# EAGLE design InstrDigitizer3 (EAGLE 8.5.2)

## Sheet 1 of 2
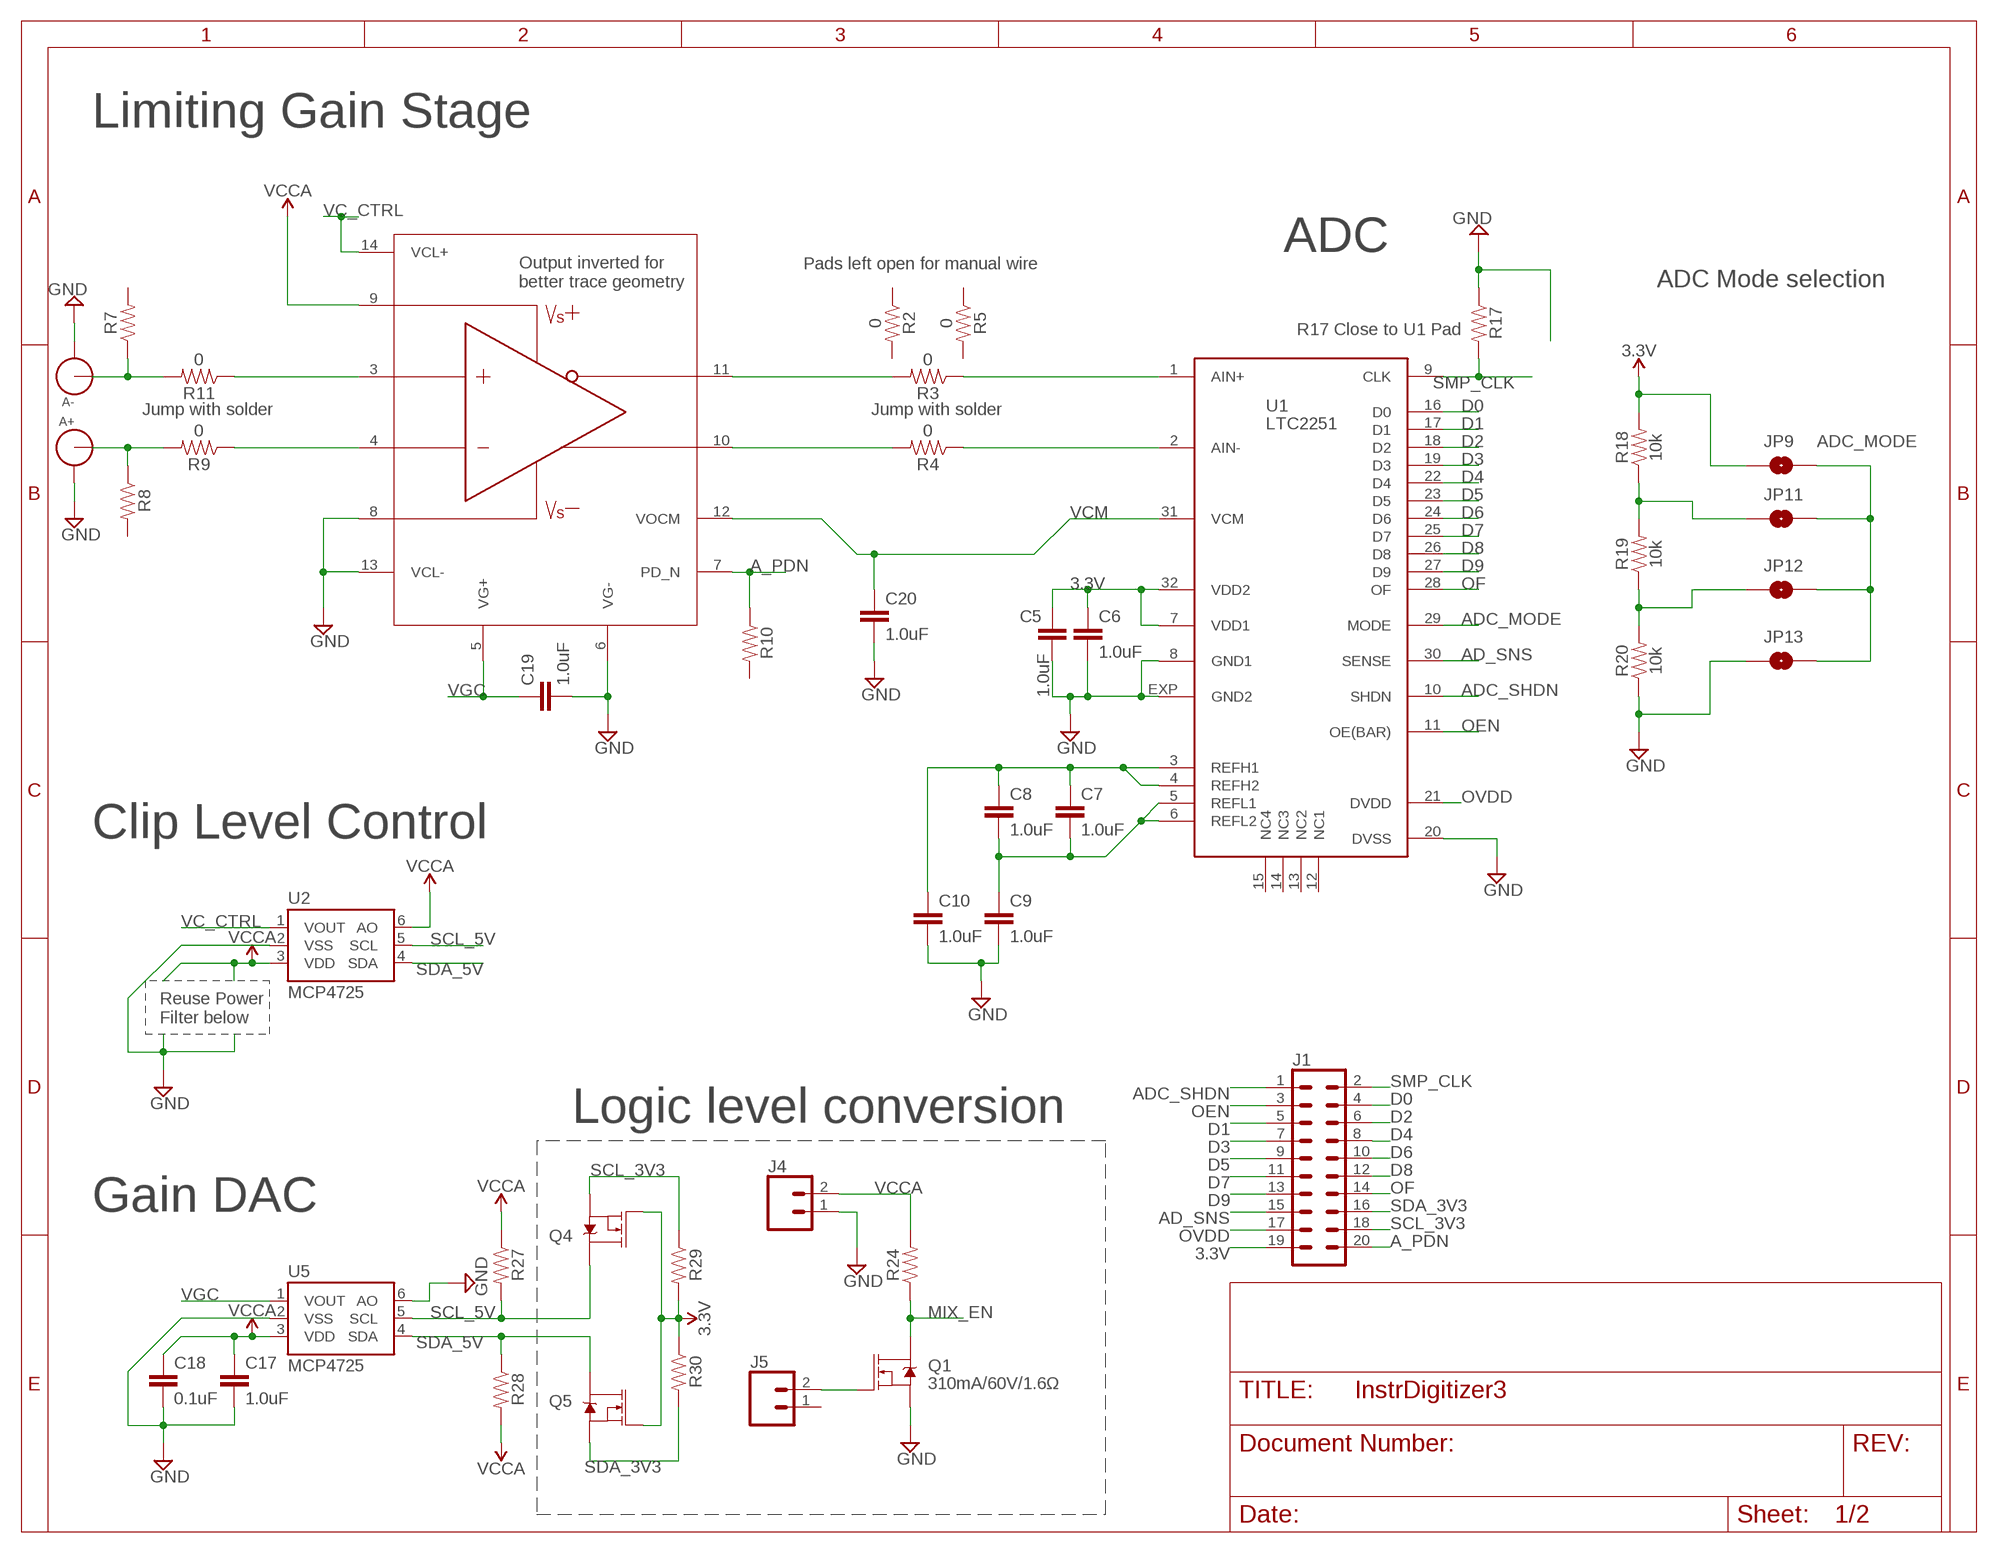
[diagram p0: schematic, sheet 1]

### Parts
A+  LINX-SMA-EDGE-0.062  [CONSMA003.062]
A-  LINX-SMA-EDGE-0.062  [CONSMA003.062]
C5  1.0uF  1.0UF-0402-16V-10%  [0402]
C6  1.0uF  1.0UF-0402-16V-10%  [0402]
C7  1.0uF  1.0UF-0402-16V-10%  [0402]
C8  1.0uF  1.0UF-0402-16V-10%  [0402]
C9  1.0uF  1.0UF-0402-16V-10%  [0402]
C10  1.0uF  1.0UF-0402-16V-10%  [0402]
C17  1.0uF  1.0UF-0402-16V-10%  [0402]
C18  0.1uF  0.1UF-0402-16V-10%  [0402]
C19  1.0uF  1.0UF-0402-16V-10%  [0402]
C20  1.0uF  1.0UF-0402-16V-10%  [0402]
J1  CONN_10X2  [2X10]
J4  CONN_02  [1X02]
J5  CONN_02  [1X02]
JP9  JUMPER-SMT_2_NO_NO-SILK  [SMT-JUMPER_2_NO_NO-SILK]
JP11  JUMPER-SMT_2_NO_NO-SILK  [SMT-JUMPER_2_NO_NO-SILK]
JP12  JUMPER-SMT_2_NO_NO-SILK  [SMT-JUMPER_2_NO_NO-SILK]
JP13  JUMPER-SMT_2_NO_NO-SILK  [SMT-JUMPER_2_NO_NO-SILK]
Q1  310mA/60V/1.6Ω  MOSFET-NCH-2N7002PW  [SOT323]
Q4  MOSFET-NCH-AO3404A  [SOT23-3]
Q5  MOSFET-NCH-AO3404A  [SOT23-3]
R2  0  RESISTOR0402  [0402]
R3  0  RESISTOR0402  [0402]
R4  0  RESISTOR0402  [0402]
R5  0  RESISTOR0402  [0402]
R7  RESISTOR0402  [0402]
R8  RESISTOR0402  [0402]
R9  0  RESISTOR0402  [0402]
R10  RESISTOR0402  [0402]
R11  0  RESISTOR0402  [0402]
R17  RESISTOR0402  [0402]
R18  10k  RESISTOR0402  [0402]
R19  10k  RESISTOR0402  [0402]
R20  10k  RESISTOR0402  [0402]
R24  RESISTOR0402  [0402]
R27  RESISTOR0402  [0402]
R28  RESISTOR0402  [0402]
R29  RESISTOR0402  [0402]
R30  RESISTOR0402  [0402]
U1  LTC2251  [HVQFN32]
U2  MCP4725  MCP4725SOT-23  [SOT23-6]
U5  MCP4725  MCP4725SOT-23  [SOT23-6]
U$1  THS7530  [TSSOP14]

### Nets
3.3V: C5.1 C6.1 J1.19 JP9.1 Q4.1(G) Q5.1(G) R18.2 R29.2 R30.1 U1.7(VDD1) U1.32(VDD2) ; also sheet 2
A_PDN: J1.20 R10.1 U$1.7(PD_N)
AD_SNS: J1.15 U1.30(SENSE)
ADC_MODE: JP9.2 JP11.2 JP12.2 JP13.2 U1.29(MODE)
ADC_SHDN: J1.1 U1.10(SHDN)
D0: J1.4 U1.16(D0)
D1: J1.5 U1.17(D1)
D2: J1.6 U1.18(D2)
D3: J1.7 U1.19(D3)
D4: J1.8 U1.22(D4)
D5: J1.9 U1.23(D5)
D6: J1.10 U1.24(D6)
D7: J1.11 U1.25(D7)
D8: J1.12 U1.26(D8)
D9: J1.13 U1.27(D9)
GND: A+.GND1 A+.GND2 A+.GND3 A+.GND4 A-.GND1 A-.GND2 A-.GND3 A-.GND4 C5.2 C6.2 C9.2 C10.2 C17.2 C18.2 C19.2 C20.2 J4.1 JP13.1 Q1.2(S) R17.1 R20.1 U1.8(GND1) U1.20(DVSS) U1.EXP(GND2) U2.2(VSS) U5.2(VSS) U5.6(AO) U$1.6(VG-) U$1.8 U$1.13(VCL-) ; also sheet 2
MIX_EN: Q1.3(D) R24.1 ; also sheet 2
N$1: R11.1 U$1.3
N$2: A+.ANT R8.1 R9.2
N$3: J5.2 Q1.1(G)
N$4: R3.1 U1.1(AIN+)
N$5: R3.2 U$1.11(VO-)
N$6: R4.1 U1.2(AIN-)
N$7: R4.2 U$1.10(VO+)
N$10: A-.ANT R7.1 R11.2
N$11: R9.1 U$1.4
N$21: C7.1 C8.1 C10.1 U1.3(REFH1) U1.4(REFH2)
N$22: JP12.1 R19.1 R20.2
N$23: C7.2 C8.2 C9.1 U1.5(REFL1) U1.6(REFL2)
N$30: JP11.1 R18.1 R19.2
OEN: J1.3 U1.11(OE(BAR))
OF: J1.14 U1.28(OF)
OVDD: J1.17 U1.21(DVDD)
SCL_3V3: J1.18 Q4.2(S) R29.1
SCL_5V: Q4.3(D) R27.2 U2.5(SCL) U5.5(SCL)
SDA_3V3: J1.16 Q5.2(S) R30.2
SDA_5V: Q5.3(D) R28.1 U2.4(SDA) U5.4(SDA)
SMP_CLK: J1.2 R17.2 U1.9(CLK)
VC_CTRL: U2.1(VOUT) U$1.14(VCL+)
VCCA: C17.1 C18.1 J4.2 R24.2 R27.1 R28.2 U2.3(VDD) U2.6(AO) U5.3(VDD) U$1.9 ; also sheet 2
VCM: C20.1 U1.31(VCM) U$1.12(VOCM)
VGC: C19.1 U5.1(VOUT) U$1.5(VG+)
Unconnected: J5.1 R2.1 R2.2 R5.1 R5.2 R7.2 R8.2 R10.2 U1.12(NC1) U1.13(NC2) U1.14(NC3) U1.15(NC4)

### Notes on the sheet
- Limiting Gain Stage
- ADC
- Pads left open for manual wire
- Output inverted for 
  better trace geometry
- ADC Mode selection
- R17 Close to U1 Pad
- Jump with solder | Jump with solder
- Clip Level Control
- Reuse Power
  Filter below
- Logic level conversion
- Gain DAC

## Sheet 2 of 2
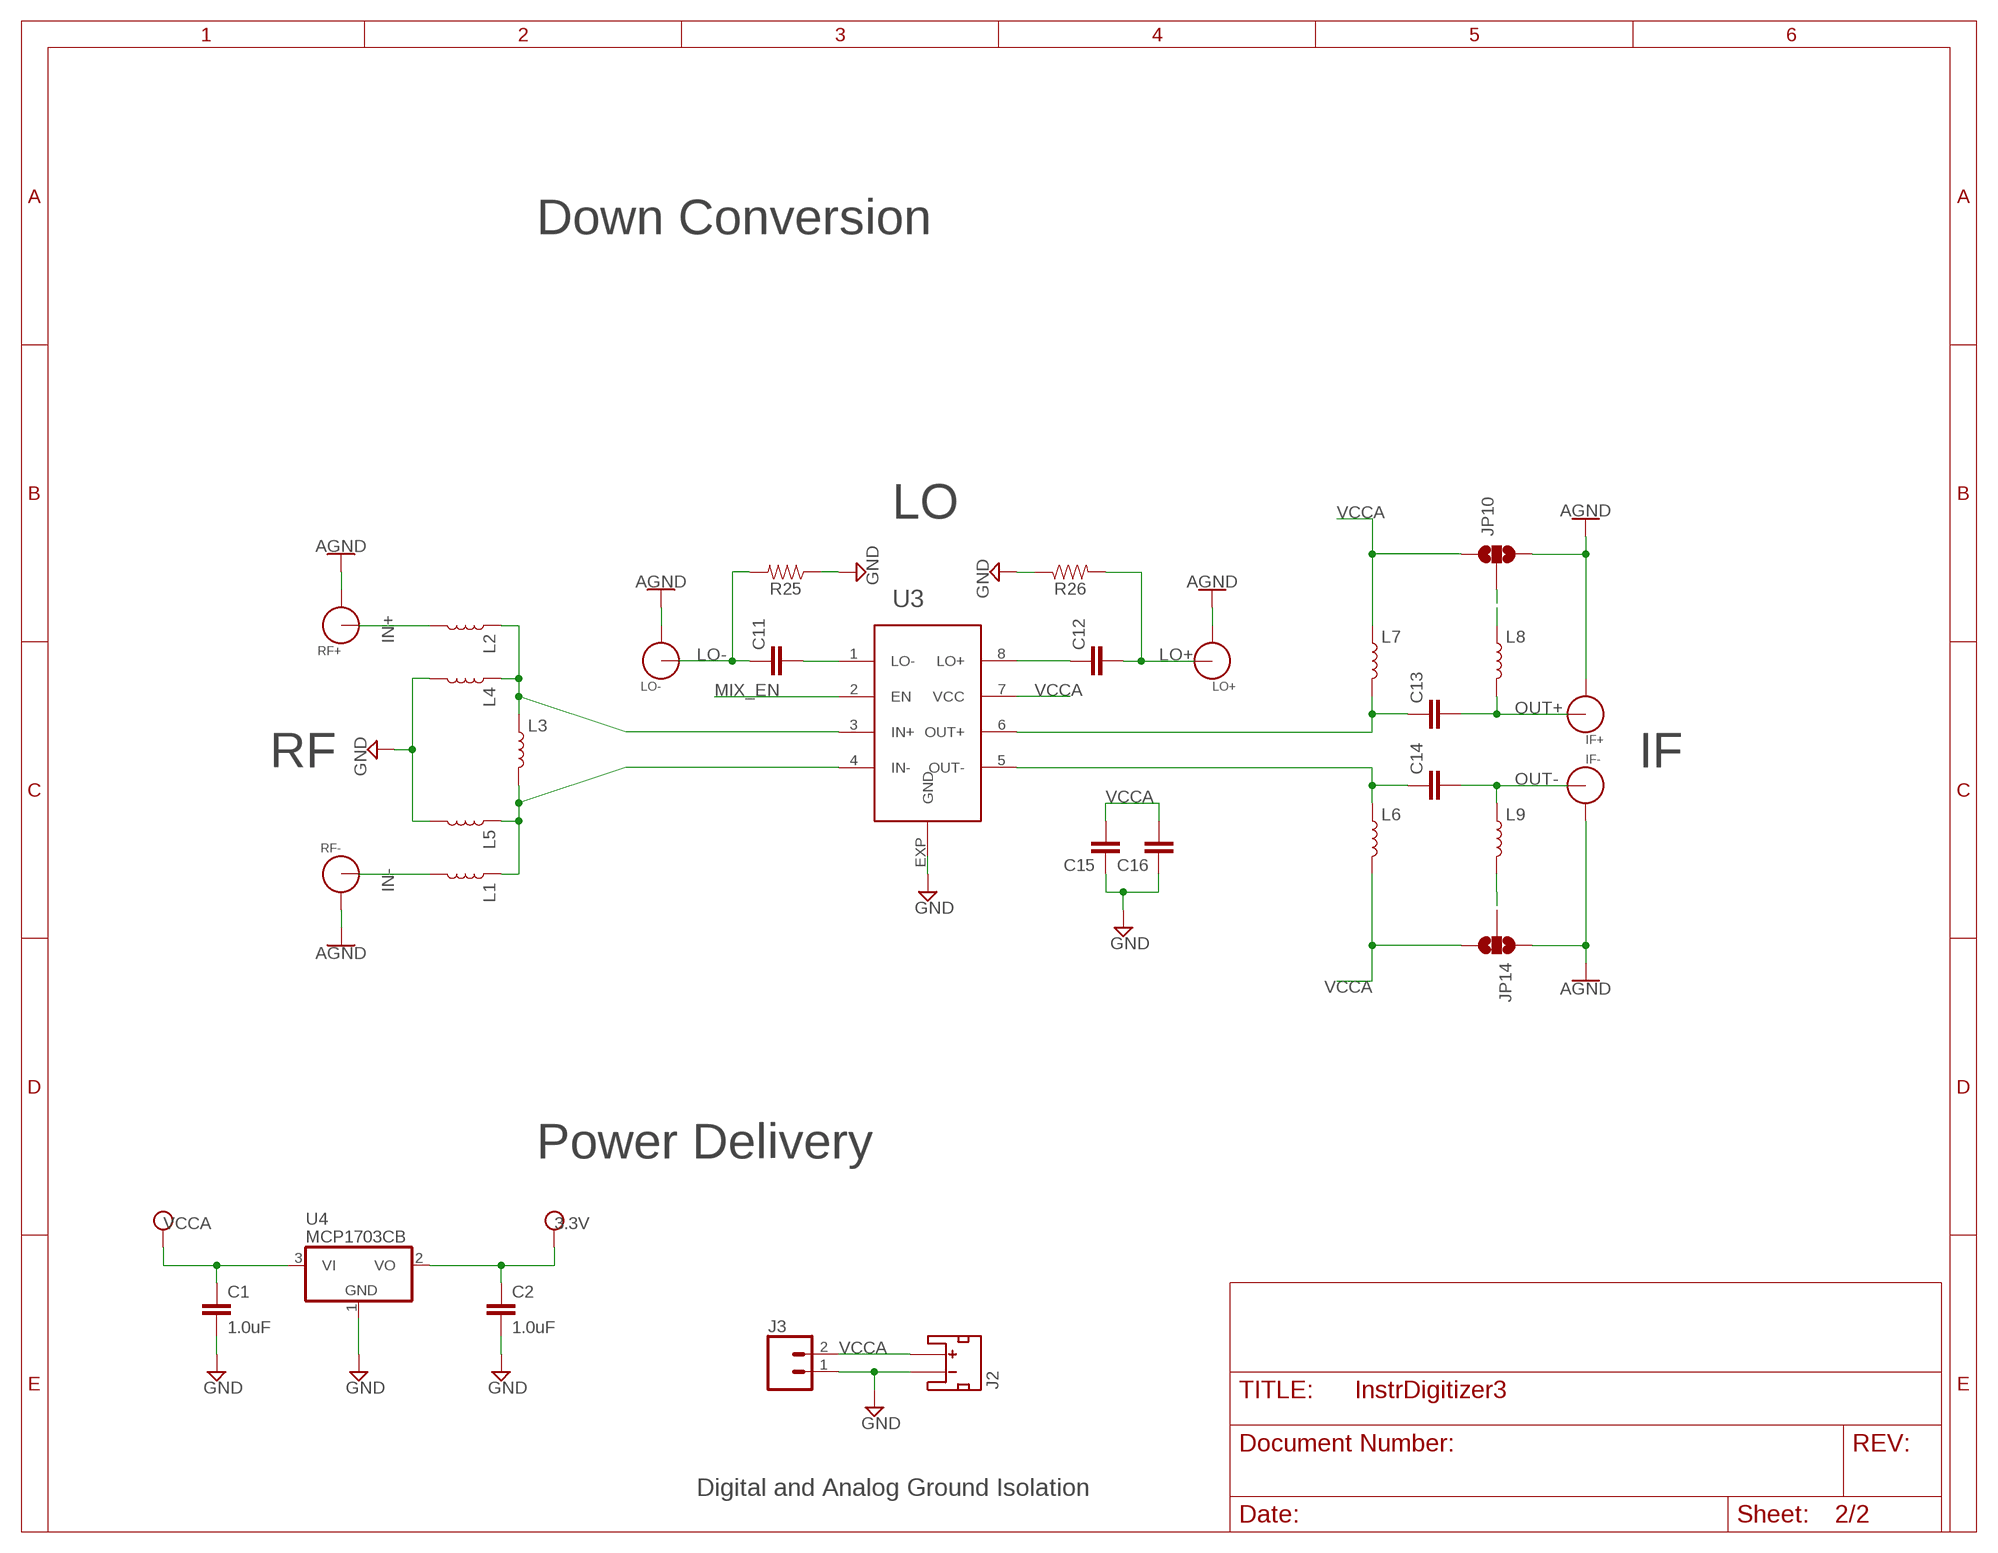
[diagram p1: schematic, sheet 2]

### Parts
C1  1.0uF  1.0UF-0402-16V-10%  [0402]
C2  1.0uF  1.0UF-0402-16V-10%  [0402]
C11  1.0UF-0402-16V-10%  [0402]
C12  1.0UF-0402-16V-10%  [0402]
C13  1.0UF-0402-16V-10%  [0402]
C14  1.0UF-0402-16V-10%  [0402]
C15  1.0UF-0402-16V-10%  [0402]
C16  1.0UF-0402-16V-10%  [0402]
IF+  LINX-SMA-EDGE-0.062  [CONSMA003.062]
IF-  LINX-SMA-EDGE-0.062  [CONSMA003.062]
J2  JST_2MM_MALE  [JST-2-SMD]
J3  CONN_02  [1X02]
JP10  JUMPER-SMT_3_NO_NO-SILK  [SMT-JUMPER_3_NO_NO-SILK]
JP14  JUMPER-SMT_3_NO_NO-SILK  [SMT-JUMPER_3_NO_NO-SILK]
L1  INDUCTOR-0603-33NH  [0603]
L2  INDUCTOR-0603-33NH  [0603]
L3  INDUCTOR-0603-33NH  [0603]
L4  INDUCTOR-0603-33NH  [0603]
L5  INDUCTOR-0603-33NH  [0603]
L6  INDUCTOR-0603-33NH  [0603]
L7  INDUCTOR-0603-33NH  [0603]
L8  INDUCTOR-0603-33NH  [0603]
L9  INDUCTOR-0603-33NH  [0603]
LO+  LINX-SMA-EDGE-0.062  [CONSMA003.062]
LO-  LINX-SMA-EDGE-0.062  [CONSMA003.062]
R25  RESISTOR0402  [0402]
R26  RESISTOR0402  [0402]
RF+  LINX-SMA-EDGE-0.062  [CONSMA003.062]
RF-  LINX-SMA-EDGE-0.062  [CONSMA003.062]
U3  LT5560  [DFN8-3X3]
U4  MCP1703CB  [SOT23]

### Nets
3.3V: C2.1 U4.2(VO) ; supply symbol labelled VDD ; also sheet 1
GND: C1.2 C2.2 C15.1 C16.1 IF+.GND1 IF+.GND2 IF+.GND3 IF+.GND4 IF-.GND1 IF-.GND2 IF-.GND3 IF-.GND4 J2.1(-) J3.1 JP10.3 JP14.1 L4.2 L5.2 LO+.GND1 LO+.GND2 LO+.GND3 LO+.GND4 LO-.GND1 LO-.GND2 LO-.GND3 LO-.GND4 R25.1 R26.1 RF+.GND1 RF+.GND2 RF+.GND3 RF+.GND4 RF-.GND1 RF-.GND2 RF-.GND3 RF-.GND4 U3.EXP(GND) U4.1(GND) ; supply symbol labelled AGND ; also sheet 1
IN+: L2.2 RF+.ANT
IN-: L1.2 RF-.ANT
LO+: C12.2 LO+.ANT R26.2
LO-: C11.1 LO-.ANT R25.2
MIX_EN: U3.2(EN) ; also sheet 1
N98: L1.1 L3.2 L5.1 U3.4(IN-)
N$20: C11.2 U3.1(LO-)
N$24: C12.1 U3.8(LO+)
N$25: L2.1 L3.1 L4.1 U3.3(IN+)
N$26: C14.1 L6.1 U3.5(OUT-)
N$27: C13.1 L7.2 U3.6(OUT+)
N$37: JP10.2 L8.1
N$38: JP14.2 L9.2
OUT+: C13.2 IF+.ANT L8.2
OUT-: C14.2 IF-.ANT L9.1
VCCA: C1.1 C15.2 C16.2 J2.2(+) J3.2 JP10.1 JP14.3 L6.2 L7.1 U3.7(VCC) U4.3(VI) ; supply symbol labelled VCC ; also sheet 1
Unconnected: J2.NC1(PAD1) J2.NC2(PAD2)

### Notes on the sheet
- Down Conversion
- LO
- U3
- RF | IF
- Power Delivery
- Digital and Analog Ground Isolation

## Library data of the parts
A+ A- IF+ IF- LO+ LO- RF+ RF- = connector:LINX-SMA-EDGE-0.062: CONN SMA JACK 50 OHM EDGE MNT; DIGIKEY: CONSMA003.062-ND
C1 C2 C5-C10 C17 C19 C20 = SparkFun-Capacitors:1.0UF: 1µF ceramic capacitors A capacitor is a passive two-terminal electrical component used to store electrical energy temporarily in an electric field.; PROD_ID: CAP-12417
C11-C16 = SparkFun-Capacitors:1.0UF: 1µF ceramic capacitors A capacitor is a passive two-terminal electrical component used to store electrical energy temporarily in an electric field.; PROD_ID: CAP-12417; VALUE: 1.0uF
C18 = SparkFun-Capacitors:0.1UF: 0.1µF ceramic capacitors A capacitor is a passive two-terminal electrical component used to store electrical energy temporarily in an electric field.; PROD_ID: CAP-12416
J1 = SparkFun-Connectors:CONN_10X2: Multi connection point. Often used as Generic Header-pin footprint for 0.1 inch spaced/style header connections On any of the 0.1 inch spaced packages, you can populate with these: Break Away Headers - Straight <https://www.sparkfun.com/products/116> (PRT-00116) Break Away Male Headers - Right Angle <https://www.sparkfun.com/products/553> (PRT-00553) Female Headers <https://www.sparkfun.com/products/115> (PRT-00115) Break Away Headers - Machine Pin <https://www.sparkfun.com/products/117> (PRT-00117) Break Away Female Headers - Swiss Machine Pin <https://www.sparkfun.com/products/743> (PRT-00743) Special note about the "SPECIAL" package: This was SPECIALLY designed to be used with our Graphic LCD Backpack. Be sure you want to use this! It is not only staggered on each line of header holes, but IT IS ALSO offset of the center point of the top and bottom lines by 5 mil. This causes the headers to lock into place on the "standard" footprint on the LCD screen. The extra squares on the tdocu layer are there simply to reference other pins (if you were to actually populate a longer header than ten long - this is what we do with the backpacks).
J2 = SparkFun-Connectors:JST_2MM_MALE: JST 2MM MALE RA CONNECTOR Two pin, compact surface mount connector. Commonly used as a battery input connection point. We really like the solid locking feeling and high current rating on these small connectors. We use these all the time as battery connectors. Mates to single-cell LiPo batteries. Here is the connector we sell at SparkFun: JST Right Angle Connector - White <https://www.sparkfun.com/products/8612> (PRT-08612) Datasheet <http://www.sparkfun.com/datasheets/Prototyping/Connectors/JST-Horizontal.pdf> It was used on these SparkFun products: SparkFun MOSFET Power Controller <https://www.sparkfun.com/products/11214> (PRT-11214) SparkFun Battery Babysitter - LiPo Battery Manager <https://www.sparkfun.com/products/13777> (PRT-13777) And many, many others that required a lipo battery connection.; PROD_ID: CONN-11443; SF_ID: PRT-08612
J3-J5 = SparkFun-Connectors:CONN_02: Multi connection point. Often used as Generic Header-pin footprint for 0.1 inch spaced/style header connections On any of the 0.1 inch spaced packages, you can populate with these: Break Away Headers - Straight <https://www.sparkfun.com/products/116> (PRT-00116) Break Away Male Headers - Right Angle <https://www.sparkfun.com/products/553> (PRT-00553) Female Headers <https://www.sparkfun.com/products/115> (PRT-00115) Break Away Headers - Machine Pin <https://www.sparkfun.com/products/117> (PRT-00117) Break Away Female Headers - Swiss Machine Pin <https://www.sparkfun.com/products/743> (PRT-00743) For SCREWTERMINALS and SPRING TERMINALS visit here: Screw Terimnals on SparkFun.com <https://www.sparkfun.com/search/results?term=Screw+Terminals> (5mm/3.5mm/2.54mm spacing) This device is also useful as a general connection point to wire up your design to another part of your project. Our various solder wires solder well into these plated through hole pads. Hook-Up Wire - Assortment (Stranded, 22 AWG) <https://www.sparkfun.com/products/11375> (PRT-11375) Hook-Up Wire - Assortment (Solid Core, 22 AWG) <https://www.sparkfun.com/products/11367> (PRT-11367) View the entire wire category on our website here <https://www.sparkfun.com/categories/141> Special notes: Molex polarized connector foot print use with: PRT-08233 with associated crimp pins and housings. 2.54_SCREWTERM for use with PRT-10571. 3.5mm Screw Terminal footprints for PRT-08084 5mm Screw Terminal footprints for use with PRT-08432
JP9 JP11-JP13 = SparkFun-Jumpers:JUMPER-SMT_2_NO: Normally open jumper This jumper has two pads in close proximity to each other. Apply solder to close the connection. Round pads are easier to solder for beginners, but are a lot larger. SparkFun Product that uses the round pads: SparkFun EL Sequencer <https://www.sparkfun.com/products/12781>
JP10 JP14 = SparkFun-Jumpers:JUMPER-SMT_3_NO: Normally open jumper This jumper has three pads in close proximity to each other. Apply solder to close the connection(s).
L1-L9 = SparkFun-Coils:INDUCTOR: Inductors Resist changes in electrical current. Basically a coil of wire. SparkFun Products: SparkFun Load Cell Amplifier - HX711 <https://www.sparkfun.com/products/13879> IOIO-OTG - V2.2 <https://www.sparkfun.com/products/13613>; PROD_ID: NDUC-07874; VALUE: 33nH/±5%/500mA
Q1 = SparkFun-DiscreteSemi:MOSFET-NCH: N-channel MOSFETs Voltage controlled devices that allow control of high current outputs. SparkFun Products: SparkFun OpenScale <https://www.sparkfun.com/products/13261> SparkFun Digital Sandbox <https://www.sparkfun.com/products/12651> SparkFun Monster Moto Shield <https://www.sparkfun.com/products/10182> SparkFun MOSFET Power Controller <https://www.sparkfun.com/products/11214>; PROD_ID: TRANS-11151
Q4 Q5 = SparkFun-DiscreteSemi:MOSFET-NCH: N-channel MOSFETs Voltage controlled devices that allow control of high current outputs. SparkFun Products: SparkFun OpenScale <https://www.sparkfun.com/products/13261> SparkFun Digital Sandbox <https://www.sparkfun.com/products/12651> SparkFun Monster Moto Shield <https://www.sparkfun.com/products/10182> SparkFun MOSFET Power Controller <https://www.sparkfun.com/products/11214>; PROD_ID: TRANS-12988; VALUE: 5.8A/30V/35mΩ
R2-R5 R7-R11 R17-R20 R24-R30 = SparkFun-Resistors:RESISTOR: Generic Resistor Package
U1 = components:LTC2251: LTC2251 125MSPS Pipelined ADC
U2 U5 = SparkFun-IC-Conversion:MCP4725: MCP4725 DAC Microchip 12-bit I2C DAC, SOT23-6 Datasheet <https://cdn.sparkfun.com/datasheets/BreakoutBoards/MCP4725_2009.pdf> SparkFun Products SparkFun I2C DAC Breakout - MCP4725 <https://www.sparkfun.com/products/12918> (BOB-12918); PROD_ID: IC-08886
U3 = components:LT5560
U4 = linear:MCP1703: 250 mA, 16V, Low Quiescent Current LDO Regulator Source: http://ww1.microchip.com/downloads/en/DeviceDoc/22049b.pdf
U$1 = components:THS7530

## Board
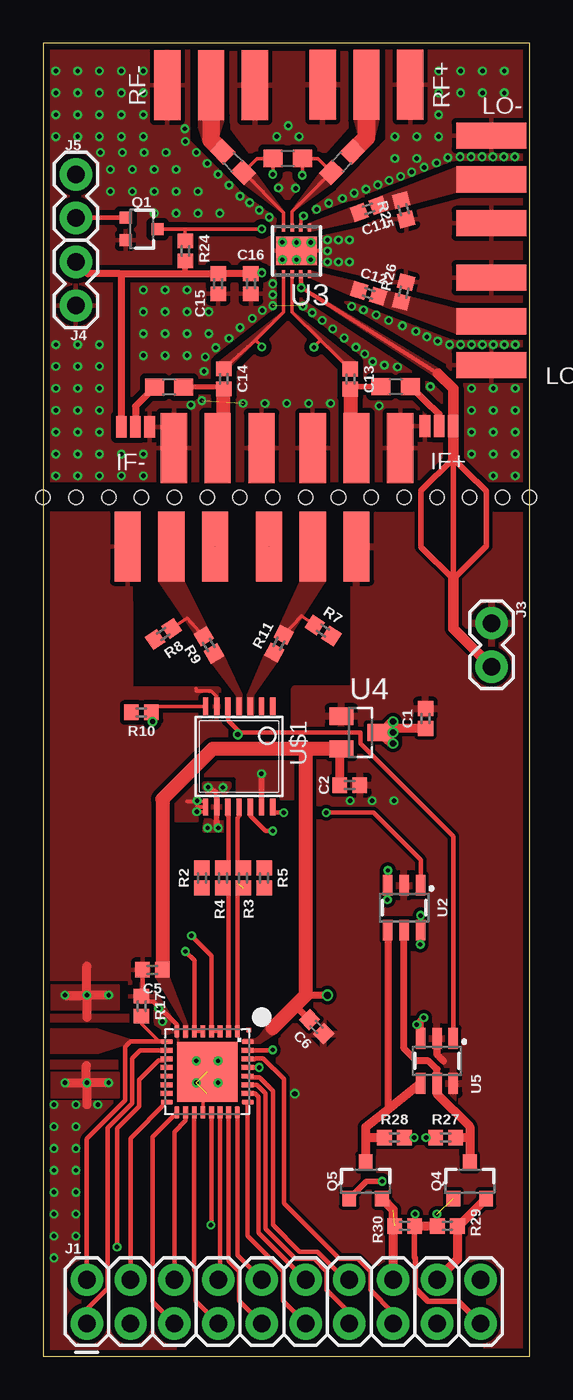
[diagram p2: board, top side]
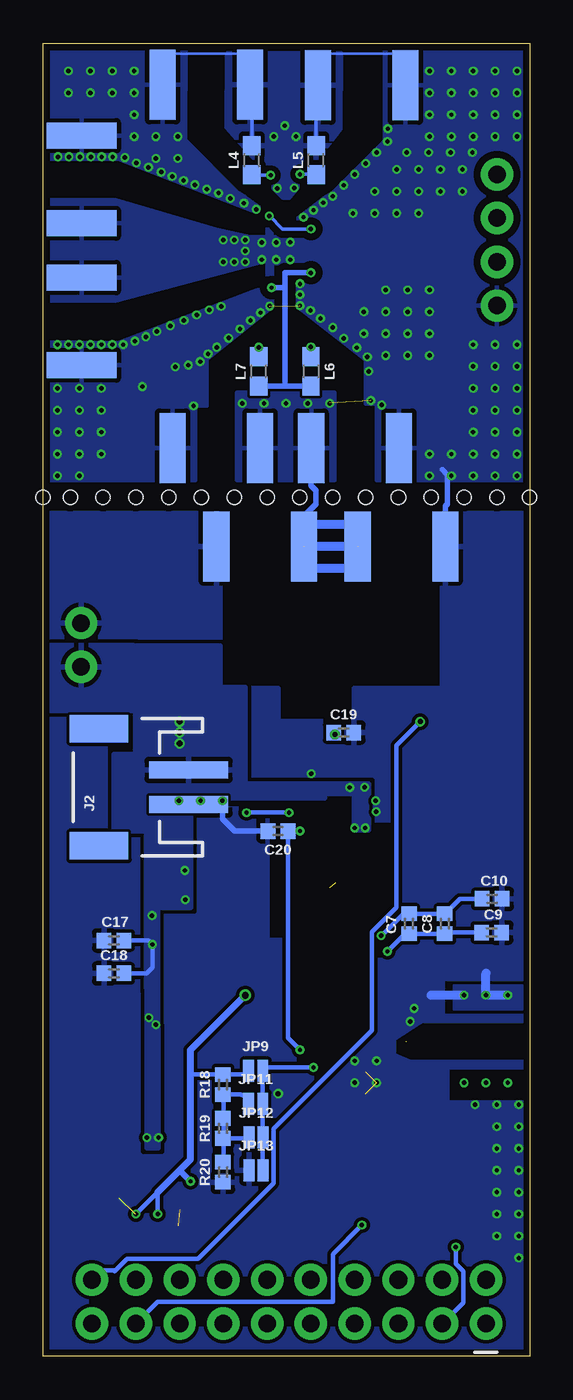
[diagram p3: board, bottom side, seen from below]

Size 28.25 x 76.19 mm. Coordinates in mm from the lower left corner, seen from the top.
Outline: 0,0 28.25,0 28.25,76.19 0,76.19 0,0
Copper layers (1*16): Top 0.0356mm / dielectric 60mil / Bottom 0.0356mm
Design rules "default *": minimum track width 6mil, minimum drill 10mil, track to track 6mil, track to pad 6mil, pad to pad 6mil, via to via 6mil, smd to smd 0mil, copper to edge 15mil, drill to drill 10mil, minimum pad ring 5mil, minimum via ring 5mil, stop-mask expansion 4mil, vias tented up to drill 20mil, thermal gap 10mil
Holes 0.8 mm at 0,49.83 1.91,49.83 3.81,49.83 5.71,49.83 7.62,49.83 9.53,49.83 11.43,49.83 13.34,49.83 15.24,49.83 17.14,49.83 19.05,49.83 20.95,49.83 22.86,49.83 24.77,49.83 26.67,49.83 28.24,49.83

### Footprints (pad centres in the part's own frame; a part is rotated, then mirrored left to right if it is on the bottom)
CONSMA003.062 = smd 4.06 x 1.52: ANT 0,0; GND1 0,2.54; GND2 0,-2.54 | smd 4.06 x 1.52 bottom: GND3 0,2.54; GND4 0,-2.54
0402 = smd 0.85 x 0.9: 1 -0.58,0; 2 0.58,0
2X10 = drill 1.016 pad 1.88: 1 0,0; 2 0,2.54; 3 2.54,0; 4 2.54,2.54; 5 5.08,0; 6 5.08,2.54; 7 7.62,0; 8 7.62,2.54; 9 10.16,0; 10 10.16,2.54; 11 12.7,0; 12 12.7,2.54; 13 15.24,0; 14 15.24,2.54; 15 17.78,0; 16 17.78,2.54; 17 20.32,0; 18 20.32,2.54; 19 22.86,0; 20 22.86,2.54
JST-2-SMD = smd 1 x 4.6: 1 -1,-3.7; 2 1,-3.7 | smd 1.6 x 3.4: NC1 -3.4,1.5; NC2 3.4,1.5
1X02 = drill 1.016 pad 1.88: 1 0,0; 2 2.54,0
SMT-JUMPER_2_NO_NO-SILK = smd 0.635 x 1.27: 1 -0.406,0; 2 0.406,0
SMT-JUMPER_3_NO_NO-SILK = smd 0.635 x 1.27: 1 -0.813,0; 2 0,0; 3 0.813,0
0603 = smd 1.1 x 1: 1 -0.85,0; 2 0.85,0
SOT323 = smd 0.7 x 0.7: 1 -0.65,-0.925; 2 0.65,-0.925; 3 0,0.925
SOT23-3 = smd 0.8 x 0.9: 1 -0.95,-1; 2 0.95,-1; 3 0,1.1
HVQFN32 = smd 0.7 x 0.28: 1 -2.35,1.75; 2 -2.35,1.25; 3 -2.35,0.75; 4 -2.35,0.25; 5 -2.35,-0.25; 6 -2.35,-0.75; 7 -2.35,-1.25; 8 -2.35,-1.75; 17 2.35,-1.75; 18 2.35,-1.25; 19 2.35,-0.75; 20 2.35,-0.25; 21 2.35,0.25; 22 2.35,0.75; 23 2.35,1.25; 24 2.35,1.75 | smd 0.28 x 0.7: 9 -1.75,-2.35; 10 -1.25,-2.35; 11 -0.75,-2.35; 12 -0.25,-2.35; 13 0.25,-2.35; 14 0.75,-2.35; 15 1.25,-2.35; 16 1.75,-2.35; 25 1.75,2.35; 26 1.25,2.35; 27 0.75,2.35; 28 0.25,2.35; 29 -0.25,2.35; 30 -0.75,2.35; 31 -1.25,2.35; 32 -1.75,2.35 | smd 3.5 x 3.5: EXP 0,0 | smd 0.25 x 0.25: M1 -2.415,2.415
SOT23-6 = smd 0.55 x 1.2: 1 0.95,1.3; 2 0,1.3; 3 -0.95,1.3; 4 -0.95,-1.3; 5 0,-1.3; 6 0.95,-1.3
DFN8-3X3 = smd 0.25 x 0.45: 1 -0.75,-1.35; 2 -0.25,-1.35; 3 0.25,-1.35; 4 0.75,-1.35; 5 0.75,1.35; 6 0.25,1.35; 7 -0.25,1.35; 8 -0.75,1.35 | smd 2.38 x 1.65: EXP 0,0
SOT23 = smd 1 x 1.4: 1 -0.95,-1.1; 2 0.95,-1.1; 3 0,1.1
TSSOP14 = smd 0.305 x 0.991: 1 -1.95,-2.918; 2 -1.3,-2.918; 3 -0.65,-2.918; 4 0,-2.918; 5 0.65,-2.918; 6 1.3,-2.918; 7 1.95,-2.918; 8 1.95,2.918; 9 1.3,2.918; 10 0.65,2.918; 11 0,2.918; 12 -0.65,2.918; 13 -1.3,2.918; 14 -1.95,2.918

### Placement (x,y rotation side)
A+  7.44,46.99 90 top
A-  15.65,46.99 270 top
C1  22.2,37.01 90 top
C2  17.81,33.15 0 top
C5  6.35,22.43 180 top
C6  15.88,19.13 315 top
C7  7.01,25.1 270 bottom
C8  4.93,25.1 270 bottom
C9  2.21,24.59 0 bottom
C10  2.18,26.54 0 bottom
C11  18.9,66.57 200 top
C12  18.9,61.67 343 top
C13  17.83,56.69 270 top
C14  10.49,56.72 270 top
C15  10.16,62.23 90 top
C16  12.06,62.23 90 top
C17  24.13,24.13 180 bottom
C18  24.13,22.22 180 bottom
C19  10.79,36.2 0 bottom
C20  14.61,30.48 180 bottom
IF+  18.19,52.71 90 top
IF-  10.13,52.71 270 top
J1  2.54,1.91 0 top
J2  23.5,33.02 90 bottom
J3  26.04,42.55 270 top
J4  1.91,60.96 90 top
J5  1.91,68.58 270 top
JP9  15.9,16.56 0 bottom
JP10  22.99,53.98 180 top
JP11  15.9,14.66 0 bottom
JP12  15.88,12.7 0 bottom
JP13  15.88,10.79 0 bottom
JP14  5.36,53.92 180 top
L1  11.02,69.29 135 top
L2  17.35,69.29 45 top
L3  14.2,69.49 180 top
L4  16.13,69.39 90 bottom
L5  12.4,69.39 90 bottom
L6  12.7,57.15 270 bottom
L7  15.72,57.15 90 bottom
L8  20.47,56.26 180 top
L9  7.32,56.24 180 top
LO+  26.01,60.05 0 top
LO-  26.01,68.28 0 top
Q1  5.71,65.41 270 top
Q4  24.77,10.16 0 top
Q5  18.72,10.16 0 top
R2  9.22,27.76 90 top
R3  11.61,27.76 90 top
R4  10.44,27.76 90 top
R5  12.83,27.76 270 top
R7  16.26,42.11 327 top
R8  6.99,41.91 214 top
R9  9.63,41.28 121 top
R10  5.71,37.36 180 top
R11  13.69,41.35 62 top
R17  5.71,20.32 270 top
R18  17.81,15.77 90 bottom
R19  17.81,13.23 90 bottom
R20  17.81,10.69 90 bottom
R24  8.26,64.13 270 top
R25  20.93,66.52 105 top
R26  20.93,61.75 256 top
R27  23.37,12.7 0 top
R28  20.4,12.7 0 top
R29  23.47,7.57 180 top
R30  20.98,7.57 180 top
RF+  18.77,73.76 270 top
RF-  9.75,73.74 90 top
U1  9.53,16.51 270 top
U2  20.95,26.04 0 top
U3  14.71,64.13 180 top
U4  18.41,36.2 270 top
U5  22.86,17.14 0 top
U$1  11.38,34.8 180 top

### Tracks (layer width: path | path; a pad name or v marks a point on that pad's centre or on a via)
3.3V  (via drill 0.25, 0.4)  (1 unrouted)
  Top 0.254: R30.1 21.56,8.23 v21.59,8.25 | R29.2 22.86,7.6 v22.86,8.25
  Top 0.305: Q5.1 18.77,10.16 v19.68,10.16 | R30.1 21.56,5.75 21.61,5.69 21.61,3.93 22.34,3.2 24.11,3.2 J1.19
  Top 0.406: C6.1 14.68,20.32 14.61,20.32 | v16.51,20.95 15.24,20.95
  Top 0.508: R30.1 R29.2 | C2.1 17.23,35.16 U4.2
  Top 0.61: U4.2 16.74,35.18
  Top 0.813: U4.2 15.24,35.25 | 15.24,35.25 9.85,35.25 6.93,32.33 C5.1 | 15.24,35.25 15.24,20.95 14.61,20.32 13.34,19.05
  Bottom 0.254: JP9.1 arc90 16.51,16.35 R18.2 19.68,16.35 19.68,16.51 | v22.86,8.25 21.59,9.52 v21.59,8.25
  Bottom 0.305: v19.68,10.16 20.32,10.79
  Bottom 0.406: 21.59,9.52 20.32,10.79 19.68,11.43 19.68,16.51 19.68,17.78 v16.51,20.95
  pour Top (isolate 0.203, no thermals): 13.34,19.05 13.08,19.28 12.52,18.54 12.37,18.39 11.63,18.39 11.58,18.34 11.58,18.19 12.6,18.19 13.56,18.8
  pour Top (no thermals): 7.32,22 6.55,22 8.18,19.25 8.18,18.52 8.38,18.52 8.38,19.2
A_PDN  (via drill 0.3)
  Top 0.203: R10.1 5.99,37.72 U$1.7
  Top 0.254: R10.1 6.29,36.89 v6.35,36.83
  Bottom 0.254: v6.35,36.83 7.74,35.44 7.74,26.04 9.15,24.63 9.15,18.91 14.87,13.19 14.87,10.04 19.25,5.66 23.36,5.66 24.04,4.99 | 24.04,4.99 24.08,4.95 | 24.04,4.99 24.86,4.99 J1.20
AD_SNS
  Top 0.254: U1.30 11.89,17.25 12.28,17.25 12.33,17.3 12.77,17.3 13.97,16.1 13.97,8.89 17.2,5.66 18.29,5.66 19,4.95 19,3.86 20.32,2.54 J1.15
ADC_MODE  (via drill 0.25 pad 0.25)
  Top 0.254: U1.29 v12.55,16.76
  Bottom 0.254: v12.55,16.76 15.29,16.76 arc-90 JP9.2 JP11.2 15.49,12.72 | JP12.2 arc90 15.49,12.72 | JP13.2 arc90 15.49,10.82 15.49,12.72
ADC_SHDN
  Top 0.254: J1.1 2.54,2.72 3.76,3.94 3.76,13.26 5.18,14.68 5.18,17.29 5.64,17.75 U1.10
D0
  Top 0.254: U1.16 5.08,12.66 J1.4
D1
  Top 0.254: U1.17 6.35,12.73 6.35,3.17 J1.5
D2
  Top 0.254: U1.18 8.28,13.68 7.62,13.03 J1.6
D3
  Top 0.254: U1.19 8.78,5.01 8.84,4.95 8.84,3.23 J1.7
D4
  Top 0.254: U1.22 10.28,4.56 J1.8
D5
  Top 0.254: U1.23 10.78,5.55 11.38,4.95 11.38,3.23 J1.9
D6
  Top 0.254: U1.24 11.28,5.87 J1.10
D7
  Top 0.254: J1.11 13.92,3.23 13.92,4.95 11.88,6.99 U1.25
D8
  Top 0.254: U1.26 12.3,15.26 12.5,15.05 12.5,7.18 J1.12
D9
  Top 0.254: U1.27 12.41,15.76 12.91,15.26 12.91,7.41 14.66,5.66 15.74,5.66 16.46,4.95 16.46,3.86 17.78,2.54 J1.13
GND  (via drill 0.25, 0.25 pad 0.25, 0.25 pad 0.3, 0.3)  (6 unrouted)
  Top 0.2: 9.75,38.61 8.89,38.61 8.89,38.73 | v8.91,31.6 9.43,31.6 U$1.8 | U$1.8 8.94,31.88 v8.94,32.23 | U$1.8 9.43,32.21 8.36,32.21 | R17.1 5.77,20.9 5.77,20.95
  Top 0.203: v16.51,64.13 U3.EXP | U1.20 9.28,14.99 9.53,15.24 | U$1.6 10.08,38.28 9.75,38.61
  Top 0.254: 7.78,19.07 U1.8 7.78,19.22 6.4,20.6 6.02,20.6 R17.1 5.95,20.9 | 5.77,20.95 C5.2
  Top 0.305: U$1.13 v12.68,33.8 v12.68,33.81
  Top 0.406: U5.2 22.86,17.53 23.24,17.14
  Top 0.508: v3.81,20.95 v2.54,20.95 | v2.54,20.95 2.54,19.68 | v1.27,20.95 v2.54,20.95 | v2.54,20.95 2.54,22.63 | v1.27,15.88 v2.54,15.88 2.54,14.61 | v3.81,15.88 2.52,15.88 2.52,16.87
  Bottom 0.152: RF-.GND1 7.62,74.14 7.62,75.56 12.06,75.56 12.29,75.34 RF-.GND4 | RF+.GND1 20.95,74.12 20.95,75.56 16.51,75.56 16.22,75.28 16.22,73.73
  Bottom 0.203: L5.2 12.39,73.33 RF-.GND4 | L4.2 16.13,73.33 16.22,73.73 RF+.GND4
  Bottom 0.305: C20.2 17.14,30.48 17.83,31.17 v17.83,32.23 | J2.1 20.01,32.23 v20.37,32.23 | A+.GND3 4.9,49.33 4.78,49.45 4.78,51.14 5.08,51.44 | A-.GND4 13.11,48.74 12.4,49.45 12.4,50.22 12.7,50.52 12.7,52.07 12.68,52.1 IF-.GND1
  Bottom 0.508: A+.GND4 A-.GND4 | A+.GND4 10.16,47.17 10.16,48.26 12.7,48.26 | A+.GND4 9.98,45.9 10.16,45.72 12.7,45.72 | v3.81,20.95 5.71,20.95 | v1.27,20.95 v2.54,20.95 2.54,22.22
  other vias: 8.89,17.14 10.16,17.14 10.16,15.88 21.39,68.71 20.75,68.45 20.09,68.22 19.43,67.97 18.75,67.72 18.06,67.49 17.37,67.18 16.59,66.9 15.88,66.55 16.51,64.77 16.51,63.5 17.14,63.5 17.78,63.5 17.14,64.77 17.78,64.77 22.91,58.9 23.6,58.7 18.67,58.17 18.16,58.55 17.48,59.08 16.81,59.61 16.21,60.1 15.62,60.55 15.09,60.93 13.34,62.23 13.34,61.6 13.34,60.96 12.73,60.68 12.14,60.22 11.43,59.69 10.79,59.05 13.13,66.09 12.55,66.5 11.99,66.93 11.43,67.31 10.79,67.94 10.16,68.58 9.53,69.21 8.89,69.85 8.26,70.48 10.03,58.52 9.42,57.99 9.35,57.15 22.28,59.16 22.12,68.99 8.23,71.22 9.22,55.45 8.59,55.19 19.13,57.71 19.81,57.51 22.48,56.26 19.51,55.14 13.67,67.79 14.66,67.77 13.56,70.76 14.86,70.76 17.91,60.91 18.59,60.71 19.33,60.43 20.07,60.1 20.85,59.79 21.64,59.46 8.89,15.88 19.1,32.23 13.89,63.63 14.71,63.63 15.54,63.63 15.54,64.62 14.71,64.62 13.89,64.64 22.83,69.24 23.5,69.55 24.23,58.7 25.5,58.7 24.87,58.7 26.14,58.7 26.77,58.7 27.41,58.7 24.21,69.6 24.84,69.6 25.48,69.6 26.11,69.6 26.75,69.6 27.38,69.6 14.22,71.4 20.57,57.4 24.87,56.16 26.14,56.16 27.41,56.16 24.87,54.89 26.14,54.89 27.41,54.89 24.87,53.62 26.14,53.62 27.41,53.62 24.87,52.35 26.14,52.35 27.41,52.35 26.14,51.08 27.41,51.08 11.61,55.3 12.88,55.3 14.15,55.3 15.42,55.3 16.69,55.3 6.45,66.32 7.72,66.32 8.99,66.32 0.74,74.57 2.01,74.57 3.28,74.57 0.74,73.3 2.01,73.3 3.28,73.3 0.74,72.03 2.01,72.03 3.28,72.03 0.74,70.76 2.01,70.76 3.28,70.76 3.33,69.85 4.6,69.85 5.87,69.85 3.91,68.86 5.18,68.86 6.45,68.86 3.91,67.59 5.18,67.59 6.45,67.59 7.72,67.59 8.99,67.59 7.72,68.86 7.14,69.85 4.55,70.76 5.82,70.76 4.55,72.03 5.82,72.03 4.55,73.3 5.82,73.3 4.55,74.57 5.82,74.57 0.74,58.7 2.01,58.7 3.28,58.7 0.74,57.43 2.01,57.43 3.28,57.43 0.74,56.16 2.01,56.16 3.28,56.16 0.74,54.89 2.01,54.89 3.28,54.89 0.74,53.62 2.01,53.62 3.28,53.62 0.74,52.35 2.01,52.35 3.28,52.35 0.74,51.08 2.01,51.08 3.28,51.08 4.55,52.35 5.82,52.35 4.55,51.08 5.82,51.08 10.26,66.32 22.96,74.57 24.23,74.57 25.5,74.57 22.96,73.3 24.23,73.3 25.5,73.3 22.96,72.03 26.77,73.3 26.77,74.57 20.42,70.76 21.69,70.76 20.42,69.49 21.69,69.49 22.96,70.76 5.82,61.87 7.09,61.87 8.36,61.87 5.82,60.6 7.09,60.6 8.36,60.6 5.82,59.33 7.09,59.33 8.36,59.33 5.82,58.06 7.09,58.06 8.36,58.06 9.63,60.6 9.63,59.33 14.61,15.24 0.64,14.61 1.91,14.61 3.17,14.61 1.91,13.33 0.64,13.33 0.64,5.72 1.91,6.99 0.64,6.99 1.91,8.25 0.64,8.25 1.91,9.52 0.64,9.52 1.91,10.79 0.64,10.79 1.91,12.06 0.64,12.06 6.93,19.43 6.71,20.19
  pour Top (isolate 0.305, rank 2): 0.1,76.2 0.1,50.8 28.57,50.8 28.57,76.2 19.96,76.2 19.96,70.59 16.92,67.51 15.04,66.19 14.83,65.91 13.56,65.96 13.51,66.01 11.86,67.28 11.48,67.49 8.43,70.54 8.43,76.2
  pour Bottom (isolate 0.406, rank 2): 0.1,76.2 0.1,50.8 8.89,50.8 8.89,55.25 9.53,55.25 9.53,57.79 13.49,60.86 13.49,63.4 14.94,63.4 14.94,60.86 18.72,57.84 18.72,55.12 19.38,55.12 19.38,50.8 28.57,50.8 28.57,58.88 23.9,58.83 15.27,62.1 15.24,62.23 15.24,66.12 16.89,66.75 23.88,69.47 28.57,69.44 28.57,76.2 19.94,76.2 19.96,70.59 16.92,67.51 16.48,67.26 14.99,66.17 14.96,64.95 13.44,64.95 13.44,66.07 11.86,67.28 11.48,67.49 8.43,70.54 8.43,76.2
  pour Bottom (isolate 0.406, rank 2): 28.57,61.21 28.57,67.11 24.03,67.11 18.21,65.41 16.23,64.95 15.04,64.97 15.06,63.6 24.03,61.21
  pour Top (isolate 0.305, rank 2): 17.65,75.56 10.79,75.56 11.02,71.22 12.06,69.85 13.03,68.88 13.03,68.15 13.92,67.26 14.3,67.26 15.24,68.2 15.24,68.68 17.58,71.32
  pour Bottom (isolate 0.305, rank 2): 17.55,75.56 10.97,75.59 11.02,71.22 12.06,69.85 13.03,68.88 13.16,68.22 13.97,67.26 14.3,67.26 15.24,68.2 15.24,68.68 17.58,71.3
  pour Top (isolate 0.203, rank 2): 17.55,48.82 27.94,48.82 27.94,0.64 12.7,0.64 12.7,17.78 14.61,20.32 14.61,38.73 18.03,38.73 18.03,45.09
  pour Bottom (isolate 0.203, rank 2): 17.98,48.9 27.94,48.9 27.94,0 0,0 0,14.71 4.8,14.71 4.8,16.79 0,16.79 0,17.07 6.96,17.07 7.92,17.48 7.92,18.41 6.35,19.43 6.35,19.51 0,19.51 0,19.74 5.08,19.74 5.08,21.92 0,21.92 0,48.9 5.08,48.9 5.08,38.73 10.16,38.73 10.16,36.83 14.61,36.83 14.61,38.73 17.14,38.73 17.14,33.02 10.16,33.02 10.16,31.11 7.62,31.11 7.62,24.13 10.16,24.13 10.16,17.78 12.06,17.78 12.06,24.13 15.24,24.13 15.24,31.75 17.78,31.75 17.98,39.37
  pour Top (isolate 0.254, rank 2): 5.08,48.9 0.03,48.92 0,21.89 5.05,21.89 5.05,19.76 0,19.76 0,19.48 6.22,19.48 6.99,19 6.99,17.09 0,17.09 0,16.76 5.03,16.76 5.03,14.73 0,14.73 0,0 7.62,0 7.62,16.51 8.89,16.51 8.89,19.05 7.62,19.05 7.62,31.11 9.53,31.11 9.53,32.39 14.61,32.39 14.61,36.2 11.46,36.2 10.16,38.73 5.11,38.73
  pour Top (rank 2): 4.42,21.56 0.41,21.56 0.41,20.09 4.42,20.09
  pour Top (rank 2): 4.42,16.48 0.41,16.48 0.41,15.01 4.42,15.01
  pour Bottom: 11.33,50.83 16.99,50.83 16.99,55.91 11.33,55.91
  pour Bottom (rank 2): 0.41,21.56 4.42,21.56 4.42,20.09 0.41,20.09
IN+
  Top 1.016: L2.2 18.77,70.71 RF+.ANT
  pour Top (no thermals): 18.41,70.48 19.15,70.59 19.43,71.75 18.9,72.64 18.11,71.81 18.34,70.99
IN-
  Top 1.016: RF-.ANT 9.75,70.56 L1.2
  pour Top (isolate 0.254, no thermals): 9.53,70.48 9.35,70.51 9.09,71.3 9.09,71.91 10.41,71.91 10.41,71.68 10.11,70.69
LO+
  pour Top (no thermals): 25.4,59.69 24,59.41 19.08,61.29 19.28,61.87 24.05,60.66
LO-
  pour Top (no thermals): 24.13,67.64 24.13,68.91 24,68.91 19.05,66.98 19.28,66.37 23.98,67.64
MIX_EN  (via drill 0.25 pad 0.25)
  Top 0.203: 8.26,65.41 Q1.3 | 8.26,65.41 v12.7,65.41 | v15.11,66.17 14.96,66.01 U3.2 | R24.1 8.26,65.41
  Bottom 0.203: v12.7,65.41 14.35,65.41 v15.11,66.17
N98  (via drill 0.25 pad 0.25)
  Top 0.203: U3.4 13.96,66.36 L1.1 12.43,69.49 L3.2 13.35,68.59 v13.34,68.58
  Bottom 0.203: v13.34,68.58 12.43,68.58 L5.1
  pour Top (no thermals): 12.06,68.58 12.29,68.58 13.94,66.34 11.73,68.02
N$1
  pour Top (isolate 0.203, no thermals): 13.34,40.64 13.51,40.34 12.12,38.38 12.12,37.26 11.96,37.26 11.96,38.35 12.95,40.67
N$2
  Top 0.203: R8.1 8.36,42.85 R9.2
  Top 0.254: 7.44,45.26 A+.ANT
  pour Top (isolate 0.203, no thermals): 7.62,45.72 8.08,45.26 8.08,44.98 9.4,42.29 8.84,41.96 6.81,44.98
N$3
  Top 0.254: Q1.1 1.92,66.05 J5.2
N$4  (1 unrouted)
  Top 0.254: U1.1 11.28,27.48 arc-90 11.28,27.48
N$5
  Top 0.254: R3.2 11.28,28.34 | U$1.11 11.38,31.39 11.4,31.37 11.28,31.24 11.28,28.34 | 11.36,28.43 11.28,28.34
N$6
  Top 0.254: U1.2 10.78,27.48 10.77,27.48 10.47,27.18 R4.1
N$7
  Top 0.254: R4.2 10.77,28.34 10.77,31.32 10.72,31.37 10.73,31.38 U$1.10
N$10
  Top 0.203: R7.1 15.01,42.95 R11.2
  pour Top (isolate 0.203, no thermals): 15.24,45.72 16.28,44.96 14.45,42.11 13.84,42.37 15.16,45.26
N$11
  pour Top (isolate 0.203, no thermals): 10.16,40.64 9.86,40.26 11.3,38.33 11.3,37.26 11.46,37.26 11.46,38.33 10.39,40.64
N$20
  Top 0.203: U3.1 15.5,65.48
  pour Top (no thermals): 18.41,66.67 17.81,66.52 15.44,65.63 15.44,65.33 18.03,65.91 18.41,66.07
N$21  (via drill 0.25)
  Top 0.203: U1.3 U1.4
  Top 0.254: U1.4 9.78,23.24 v8.62,24.4
  Bottom 0.254: C10.1 4.06,26.54 C8.1 C7.1 7.34,25.68 v8.62,24.4
N$22
  Bottom 0.254: JP12.1 arc90 16.33,12.65 17.78,12.65 | 17.78,12.65 R19.1 | R20.2 arc-90 17.78,11.3 17.78,12.65
N$23  (via drill 0.25)
  Top 0.203: U1.5 8.89,18.86 U1.6
  Top 0.254: 8.89,18.86 8.79,18.96 8.79,22.96 v8.26,23.49
  Bottom 0.254: C9.1 4.86,24.59 C8.2 C7.2 7.24,24.51 v8.26,23.49
N$24
  pour Top (no thermals): 18.41,61.6 18.03,62.28 15.47,62.92 15.47,62.69 17.88,61.65
N$25  (via drill 0.25 pad 0.25)
  Top 0.203: U3.3 14.46,66.4 L2.1 15.94,69.49 L3.1 15.05,68.54 v15.04,68.53
  Bottom 0.203: v15.04,68.53 16.11,68.53 L4.1
  pour Top (no thermals): 16.51,68.58 16.08,68.58 16.08,68.61 14.43,66.4 16.69,68.02
N$26  (via drill 0.25 pad 0.25)
  Top 0.203: U3.5 13.96,60.59 12.33,58.96 | 12.33,58.96 C14.1 | v12.7,58.57 12.7,58.6 12.33,58.96
  Bottom 0.203: L6.1 v12.7,58.57
  pour Top (no thermals): 10.79,57.15 10.29,57.68 13.92,60.55 10.77,57.4
N$27  (via drill 0.25 pad 0.25)
  Top 0.203: U3.6 14.46,60.6 16.1,58.95 | 16.1,58.95 C13.1 | v15.72,58.55 15.72,58.57 16.1,58.95
  Bottom 0.203: L7.2 v15.72,58.55
  pour Top (no thermals): 17.78,57.15 18.14,57.66 14.5,60.55 17.65,57.4
N$30
  Bottom 0.254: JP11.1 arc-90 16.84,15.19 R18.1 arc90 17.78,15.17 17.78,13.79 | R19.2 arc90 17.78,13.79 | 17.78,13.79 17.78,12.7
N$37
  Top 0.406: JP10.2 22.99,54.67 L8.1
N$38
  Top 0.406: L9.2 5.36,55.13 JP14.2
OEN  (via drill 0.25 pad 0.25)
  Top 0.254: U1.11 7.09,17.18 6.71,17.18 5.59,16.06 5.59,14.51 4.29,13.22 v4.29,6.35
  Bottom 0.254: v4.29,6.35 4.29,5.38 3.86,4.95 3.86,3.12 J1.3
OF
  Top 0.254: U1.28 11.96,16.18 12.56,16.18 13.34,15.41 13.34,7.62 14.88,6.07 15.91,6.07 17.54,4.44 J1.14
OUT+
  Top 0.305: IF+.ANT 17.78,52.71 | C13.2 17.78,56.25 L8.2
  Top 0.813: C13.2 17.83,52.71 IF+.ANT
OUT-
  Top 0.305: 10.64,52.71 IF-.ANT | C14.2 10.64,56.25 L9.1
  Top 0.813: IF-.ANT 10.49,53.06 C14.2
OVDD  (via drill 0.25 pad 0.25)
  Top 0.254: U1.21 9.78,7.65 v9.74,7.62
  Bottom 0.254: v9.74,7.62 11.43,5.93 11.43,3.17 21.59,3.17 J1.17
SCL_3V3
  Top 0.508: Q4.2 24.12,7.57 R29.1 24.05,5.64 J1.18
SCL_5V
  Top 0.406: U5.5 22.86,16.66 22.38,17.14 21.67,17.14 20.95,17.86 U2.5
  Top 0.508: U5.5 22.86,15.24 24.77,13.33 24.77,12.7 | 24.77,12.7 Q4.3 | R27.2 24.77,12.7
SDA_3V3  (1 unrouted)
  Top 0.508: Q5.2 20.32,8.51 J1.16
SDA_5V
  Top 0.406: U2.4 20,14.39 19.64,14.03
  Top 0.508: U5.4 19.64,14.03 18.72,13.29 18.72,12.7 | 18.72,12.7 Q5.3 | 18.72,12.7 R28.1
SMP_CLK  (1 unrouted)
  Top 0.203: R17.2 5.71,19.28 6.73,18.26
  Top 0.254: U1.9 6.73,18.26 5.08,18.26 4.77,17.96 4.77,14.85 2.54,12.61 J1.2
  pour Top (isolate 0.203, no thermals): -1.14,18.92 3.15,18.92 5.08,18.26 3.2,17.65 -1.14,17.65
VC_CTRL  (via drill 0.25)
  Top 0.254: v13.97,31.55 13.33,31.55 U$1.14 | v16.43,31.55 19.18,31.55 21.92,28.8 21.92,27.35 U2.1
  Bottom 0.254: v16.43,31.55 v13.97,31.55
VCCA  (via drill 0.25, 0.25 pad 0.25, 0.35)
  Top 0.203: v12.7,62.87 12.64,62.81 C16.2
  Top 0.254: U3.7 14.96,62.03 v14.99,62 | v14.99,62 15.04,62.03 | v14.99,62 22.91,57.02 | v21.92,25.58 21.91,25.56 U2.6 21.91,23.91 v21.89,23.9 | v19.99,26.49 20,26.51 U2.3 20,28.18 v20.02,28.19 | R28.2 v21.54,12.7 | R27.1 v22.23,12.7 22.2,12.7
  Top 0.305: R24.2 8.26,62.81 | U$1.9 10.08,32.37 | 10,32.75 v9.58,33.02 | U$1.9 10.08,31.12 v10.16,30.66 | U$1.9 10.08,31.11 10.08,30.73 | 23.8,45.09 23.8,52.1 | 23.8,52.1 21.93,50.22 21.93,49.28 21.92,49.28 21.92,46.97 23.8,45.09 | 23.8,52.1 25.13,50.77 25.15,50.77 25.73,50.19 25.73,47.02 23.8,45.09
  Top 0.406: J4.2 2.6,62.81 4.45,62.81 | 4.45,62.81 8.26,62.81 C15.2 C16.2 | JP14.3 4.55,62.71 4.45,62.81 | v21.69,19.25 21.91,19.04 U5.3 21.91,19.47 v22.1,19.66
  Top 0.508: C1.1 19.68,36.43 19.68,36.2
  Top 0.61: 22.91,57.02 23.8,56.13 JP10.1 23.8,52.1 | 19.68,36.2 v20.32,36.83 | 19.68,36.2 U4.3 v20.32,35.56 | 19.68,36.2 v20.32,36.2 | 23.8,45.09 23.8,42.24 J3.2
  Bottom 0.203: 14.2,62.87 14.15,62.87
  Bottom 0.254: C17.1 22.12,24.13 v21.89,23.9 21.89,22.55 22.23,22.22 C18.1
  Bottom 0.305: 14.15,62.87 v12.7,62.87 | L6.2 14.2,56.3 | 14.2,56.3 L7.1 | 14.2,56.3 14.2,62 | 14.2,62 14.2,62.87 | 14.2,62 v14.99,62
  other vias: 10.44,33.01 9.55,30.66
  pour Top: 23.5,56.52 22.94,57.07 23.01,57.18 14.99,62 22.81,56.9
  pour Top: 10.79,31.11 10.39,31.11 10.39,32.44 10.79,33.07 10.79,33.2 9.37,33.2 9.37,33.02 9.73,32.39 9.37,30.53 10.79,30.53
  pour Bottom: 9.37,33.2 16.51,33.2 16.51,38.81 17.98,38.81 17.98,41.22 27.94,41.28 27.94,37.47 22.86,37.47 22.86,34.93 24.13,34.93 24.13,30.48 22.23,30.48 22.2,12.09 21.56,12.09 21.59,26.04 19.68,26.04 19.68,32.39 11.91,32.39 11.91,32.66 10.19,32.66 10.19,30.53 9.37,30.53
  pour Top (isolate 0.305): 25.4,39.37 26.67,40.64 25.4,40.64
VCM  (via drill 0.25)
  Top 0.254: U$1.12 12.03,31.35 12.9,30.48 v13.34,30.48 | v13.34,17.78 13.31,17.76 U1.31
  Bottom 0.254: C20.1 14.03,18.47 v13.34,17.78
  Bottom 0.305: v13.34,30.48 C20.1
VGC  (via drill 0.3)
  Top 0.254: U5.1 23.81,30.16 18.41,35.56 18.41,36.2 12.7,36.2 11.43,36.2 | 11.43,36.2 10.73,36.9 U$1.5 | 11.43,36.2 11.42,36.2 v11.3,36.08
  Bottom 0.254: v11.3,36.08 11.38,36.15 C19.1